# Altium schematic sheet TMC4671.SchDoc
size A4; SheetNumber: 2; SheetTotal: 7
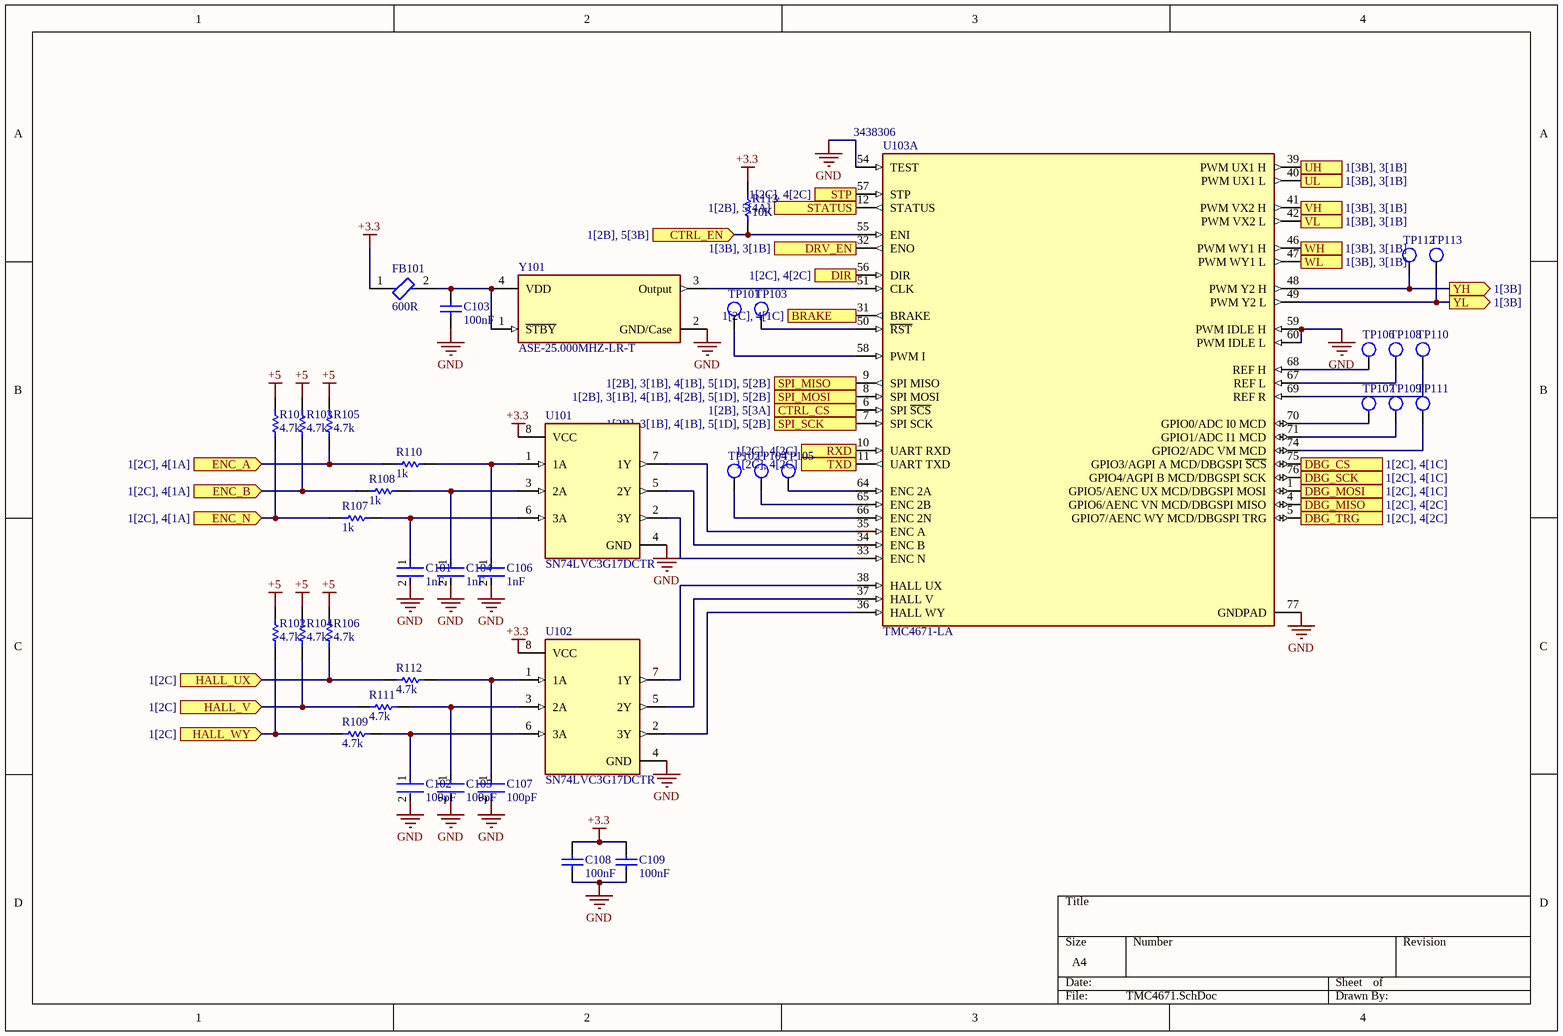
[diagram p0: TMC4671.SchDoc]

## Parts
C101  1nF  [FP-C0603C-CF-MFG]
C102  100pF  [FP-C0603C-CF-IPC_B]
C103  100nF  [CAPC1608X90X35NL10T15]
C104  1nF  [FP-C0603C-CF-MFG]
C105  100pF  [FP-C0603C-CF-IPC_B]
C106  1nF  [FP-C0603C-CF-MFG]
C107  100pF  [FP-C0603C-CF-IPC_B]
C108  100nF  [CAPC1608X90X35NL10T15]
C109  100nF  [CAPC1608X90X35NL10T15]
FB101  600R  [FP-742792651-MFG]
R101  4.7k  [RESC1608X55X30NL15T15]
R102  4.7k  [RESC1608X55X30NL15T15]
R103  4.7k  [RESC1608X55X30NL15T15]
R104  4.7k  [RESC1608X55X30NL15T15]
R105  4.7k  [RESC1608X55X30NL15T15]
R106  4.7k  [RESC1608X55X30NL15T15]
R107  1k  [RESC1608X55X30ML15T15]
R108  1k  [RESC1608X55X30ML15T15]
R109  4.7k  [RESC1608X55X30NL15T15]
R110  1k  [RESC1608X55X30ML15T15]
R111  4.7k  [RESC1608X55X30NL15T15]
R112  4.7k  [RESC1608X55X30NL15T15]
R113  10K  [RESC1609X55X30LL15T15]
TP101  TestPoint  [PCBComponent_1]  (value not drawn)  (no BOM)
TP102  TestPoint  [PCBComponent_1]  (value not drawn)  (no BOM)
TP103  TestPoint  [PCBComponent_1]  (value not drawn)  (no BOM)
TP104  TestPoint  [PCBComponent_1]  (value not drawn)  (no BOM)
TP105  TestPoint  [PCBComponent_1]  (value not drawn)  (no BOM)
TP106  TestPoint  [PCBComponent_1]  (value not drawn)  (no BOM)
TP107  TestPoint  [PCBComponent_1]  (value not drawn)  (no BOM)
TP108  TestPoint  [PCBComponent_1]  (value not drawn)  (no BOM)
TP109  TestPoint  [PCBComponent_1]  (value not drawn)  (no BOM)
TP110  TestPoint  [PCBComponent_1]  (value not drawn)  (no BOM)
TP111  TestPoint  [PCBComponent_1]  (value not drawn)  (no BOM)
TP112  TestPoint  [PCBComponent_1]  (value not drawn)  (no BOM)
TP113  TestPoint  [PCBComponent_1]  (value not drawn)  (no BOM)
U101  SN74LVC3G17DCTR  [FP-DCT0008A-IPC_B]
U102  SN74LVC3G17DCTR  [FP-DCT0008A-IPC_B]
U103  TMC4671-LA  Supplier Part Number 1: 3438306  [FP-TMC4671-LA-IPC_A]  (part A of 2)
Y101  ASE-25.000MHZ-LR-T  [FP-ASE-MFG]

## Ports
BRAKE (out, see 1[2C], 4[1C]), CTRL_CS (in, see 1[2B], 5[3A]), CTRL_EN (in, see 1[2B], 5[3B]), DBG_CS (out, see 1[2C], 4[1C]), DBG_MISO (in, see 1[2C], 4[2C]), DBG_MOSI (out, see 1[2C], 4[1C]), DBG_SCK (out, see 1[2C], 4[1C]), DBG_TRG (out, see 1[2C], 4[2C]), DIR (in, see 1[2C], 4[2C]), DRV_EN (out, see 1[3B], 3[1B]), ENC_A (in, see 1[2C], 4[1A]), ENC_B (in, see 1[2C], 4[1A]), ENC_N (in, see 1[2C], 4[1A]), HALL_UX (in, see 1[2C]), HALL_V (in, see 1[2C]), HALL_WY (in, see 1[2C]), RXD (in, see 1[2C], 4[2C]), SPI_MISO (out, see 1[2B], 3[1B], 4[1B], 5[1D], 5[2B]), SPI_MOSI (in, see 1[2B], 3[1B], 4[1B], 4[2B], 5[1D], 5[2B]), SPI_SCK (in, see 1[2B], 3[1B], 4[1B], 5[1D], 5[2B]), STATUS (out, see 1[2B], 5[4A]), STP (in, see 1[2C], 4[2C]), TXD (out, see 1[2C], 4[2C]), UH (out, see 1[3B], 3[1B]), UL (out, see 1[3B], 3[1B]), VH (out, see 1[3B], 3[1B]), VL (out, see 1[3B], 3[1B]), WH (out, see 1[3B], 3[1B]), WL (out, see 1[3B], 3[1B]), YH (out, see 1[3B]), YL (out, see 1[3B])

## Nets
+3.3: C108.1 C109.1 FB101.1 R113.2 U101.8(VCC) U102.8(VCC)
+5: R101.2 R102.2 R103.2 R104.2 R105.2 R106.2
GND: C101.2 C102.2 C103.2 C104.2 C105.2 C106.2 C107.2 C108.2 C109.2 U101.4(GND) U102.4(GND) U103.54(TEST) U103.59(PWM_IDLE_H) U103.60(PWM_IDLE_L) U103.77(GNDPAD) Y101.2(GND/Case)
BRAKE: U103.31(BRAKE) ; port BRAKE
CTRL_CS: U103.6(SPI_~{SCS}) ; port CTRL_CS
CTRL_EN: R113.1 U103.55(ENI) ; port CTRL_EN
DBG_CS: U103.75(GPIO3/AGPI_A_MCD/DBGSPI_~{SCS}) ; port DBG_CS
DBG_MISO: U103.4(GPIO6/AENC_VN_MCD/DBGSPI_MISO) ; port DBG_MISO
DBG_MOSI: U103.1(GPIO5/AENC_UX_MCD/DBGSPI_MOSI) ; port DBG_MOSI
DBG_SCK: U103.76(GPIO4/AGPI_B_MCD/DBGSPI_SCK) ; port DBG_SCK
DBG_TRG: U103.5(GPIO7/AENC_WY_MCD/DBGSPI_TRG) ; port DBG_TRG
DIR: U103.56(DIR) ; port DIR
DRV_EN: U103.32(ENO) ; port DRV_EN
ENC_A: R105.1 R110.1 ; port ENC_A
ENC_B: R103.1 R108.1 ; port ENC_B
ENC_N: R101.1 R107.1 ; port ENC_N
HALL_UX: R106.1 R112.2 ; port HALL_UX
HALL_V: R104.1 R111.2 ; port HALL_V
HALL_WY: R102.1 R109.2 ; port HALL_WY
RXD: U103.10(UART_RXD) ; port RXD
SPI_MISO: U103.9(SPI_MISO) ; port SPI_MISO
SPI_MOSI: U103.8(SPI_MOSI) ; port SPI_MOSI
SPI_SCK: U103.7(SPI_SCK) ; port SPI_SCK
STATUS: U103.12(STATUS) ; port STATUS
STP: U103.57(STP) ; port STP
TXD: U103.11(UART_TXD) ; port TXD
UH: U103.39(PWM_UX1_H) ; port UH
UL: U103.40(PWM_UX1_L) ; port UL
VH: U103.41(PWM_VX2_H) ; port VH
VL: U103.42(PWM_VX2_L) ; port VL
WH: U103.46(PWM_WY1_H) ; port WH
WL: U103.47(PWM_WY1_L) ; port WL
YH: TP112.1 U103.48(PWM_Y2_H) ; port YH
YL: TP113.1 U103.49(PWM_Y2_L) ; port YL
NetC101_1: C101.1 R107.2 U101.6(3A)
NetC102_1: C102.1 R109.1 U102.6(3A)
NetC103_1: C103.1 FB101.2 Y101.1(~{STBY}) Y101.4(VDD)
NetC104_1: C104.1 R108.2 U101.3(2A)
NetC105_1: C105.1 R111.1 U102.3(2A)
NetC106_1: C106.1 R110.2 U101.1(1A)
NetC107_1: C107.1 R112.1 U102.1(1A)
NetTP101_1: TP101.1 U103.58(PWM_I)
NetTP102_1: TP102.1 U103.66(ENC_2N)
NetTP103_1: TP103.1 U103.50(~{RST})
NetTP104_1: TP104.1 U103.65(ENC_2B)
NetTP105_1: TP105.1 U103.64(ENC_2A)
NetTP106_1: TP106.1 U103.68(REF_H)
NetTP107_1: TP107.1 U103.70(GPIO0/ADC_I0_MCD)
NetTP108_1: TP108.1 U103.67(REF_L)
NetTP109_1: TP109.1 U103.71(GPIO1/ADC_I1_MCD)
NetTP110_1: TP110.1 U103.69(REF_R)
NetTP111_1: TP111.1 U103.74(GPIO2/ADC_VM_MCD)
NetU101_2: U101.2(3Y) U103.33(ENC_N)
NetU101_5: U101.5(2Y) U103.34(ENC_B)
NetU101_7: U101.7(1Y) U103.35(ENC_A)
NetU102_2: U102.2(3Y) U103.36(HALL_WY)
NetU102_5: U102.5(2Y) U103.37(HALL_V)
NetU102_7: U102.7(1Y) U103.38(HALL_UX)
NetU103_51: U103.51(CLK) Y101.3(Output)

## Library data of the parts
C101 C104 C106 = CMP-2006-03015-2: CAP CER 1000PF 100V 10% X7R 0603; Manufacturer: KEMET; Manufacturer Part Number: C0603C102K1RACTU; Value: 1,000 pF; Tolerance: 0.1; Automotive Grade: Grade 1; Temperature Coefficient: 30ppm/°C; Material: Ceramic; Temperature Range High: +125°C; RoHS: TRUE; Temperature Range Low: -55°C; ComponentLink2URL: https://api.kemet.com/component-edge/download/datasheet/C0603C100J5GACAUTO.pdf; Lead Free: Yes; Device Class L2: Capacitors; Voltage Rating: 100 V; Package: C0603C-CF; Category: Cap; Temperature: -55°C to +125°C; Device Class L3: Ceramic Capacitors; Mouser Description: Multilayer Ceramic Capacitors MLCC - SMD/SMT 100volts 1000pF X7R 10%; Height: 0.87mm; ComponentLink2Description: Datasheet; Digikey Description: CAP CER 1000PF 100V 10% X7R 0603; Temperature Characteristic: X7R; Capacitance: 1,000 pF; Automotive: Yes; Octopart: https://octopart.com/c0603c102k1ractu-kemet-9138575; Device Class L1: Passive Components
C102 C105 C107 = CMP-2006-03007-2: CAP CER 100PF 50V 10% X7R 0603; Manufacturer: KEMET; Manufacturer Part Number: C0603C101K5RACTU; Tolerance: 0.1; Material: Ceramic; Temperature Coefficient: 30ppm/°C; Automotive Grade: Grade 1; Value: 100 pF; RoHS: TRUE; ComponentLink2Description: Datasheet; Device Class L2: Capacitors; Category: Cap; Package: C0603C-CF; Automotive: Yes; Temperature Range High: +125°C; Temperature Range Low: -55°C; Temperature Characteristic: X7R; Device Class L3: Ceramic Capacitors; Mouser Description: Multilayer Ceramic Capacitors MLCC - SMD/SMT 50volts 100pF 10%; Device Class L1: Passive Components; Capacitance: 100 pF; Height: 0.87mm; ComponentLink2URL: https://api.kemet.com/component-edge/download/datasheet/C0603C100J5GACAUTO.pdf; Temperature: -55°C to +125°C; Octopart: https://octopart.com/c0603c101k5ractu-kemet-10561249; Digikey Description: CAP CER 100PF 50V 10% X7R 0603; Voltage Rating: 50 V; Lead Free: Yes
C103 C108 C109 = CMP-2100-03643-1: Chip Capacitor, 0.1 uF, +/- 10%, 50 V, -55 to 125 degC, 0603 (1608 Metric), RoHS, Tape and Reel; Manufacturer: Murata; Dielectric Material: Ceramic; Voltage Rating: 50V; Dielectric: X7R; Insulation Resistance: 10GR; Case Code (Metric): 1608; Lead Free: LeadFree; Depth: 0.8mm; Number of Pins: 2; Radiation Hardening: No; Case/Package: 0603; Manufacturer URL: http://www.murata.com/; Packaging: TapeandReel; Length: 1.6mm; Contact Plating: Tin; Datasheet URL: http://psearch.en.murata.com/capacitor/product/GRM188R71H104KA93%23.pdf; Tolerance: 10%; Case Code (Imperial): 0603; Min Operating Temperature: -55degC; RoHSCompliant: true; Capacitance: 100nF; Voltage: 50V; Termination: SMD/SMT; Mount: SurfaceMount; Material: Ceramic; Package Quantity: 1; Height: 0.8mm; Thickness: 0.035inch; REACH SVHC: NoSVHC; Max Operating Temperature: 125degC; Width: 0.8mm; Package Reference: 0603; Voltage Rating (DC): 50V; Datasheet Version: 42675.0; Package Description: 2-Pin Surface Mount Device, Body 1.6 x 0.8 mm
FB101 = CMP-0220-00181-2: FERRITE BEAD 600 OHM 0603 1LN; Tolerance: 25%; DC Resistance (DCR): 200mR; Inductance: 0.36H; Current Rating: 1A; Test Frequency: 100MHz; Number of Lines: 1; Length: 1.6mm; Termination: SMD/SMT; Case Code (Metric): 1608; Case/Package: SMD/SMT; Min Operating Temperature: -55°C; Resistance: 200mR; Height: 0.8mm; Width: 0.8mm; Max Operating Temperature: 125°C; Package Quantity: 1; Mount: Surface Mount; Max DC Current: 1A; Max Current Rating: 1A; Weight: 0.000141oz; Packaging: Tape and Reel; Lead Free: Lead Free; Case Code (Imperial): 0603; Series: WE-CBF; Impedance: 600R; Core Material: Ferrite; Material: Ferrite; RoHS Compliant: Yes; Depth: 0.8mm
R101-R106 R109 R111 R112 = CMP-1012-00586-3: Precision Thick Film Chip Resistor, 4.7 KOhm, +/- 1%, -55 to 155 degC, 0603 (1608 Metric), RoHS, Tape and Reel; Resistance: 220 Ohm; Voltage Rating: 50 V; Elements: 4; Case\Package: 1205; Tolerance: 5%; Power Rating: 250 mW; PackageReference: 0603; Max Operating Temperature: 125 degC; REACH SVHC: No SVHC; Width: 0.063 inch; Length: 0.126 inch; Height: 0.024 inch; Mount: Surface Mount; Package Quantity: 1; DatasheetVersion: Apr-15; ComponentLink1Description: Manufacturer URL; Min Operating Temperature: -55 degC; Packaging: Tape and Reel; Radiation Hardening: No; ComponentLink2URL: http://industrial.panasonic.com/cdbs/www-data/pdf/RDA0000/AOA0000C86.pdf; Case Code (Metric): 3216; Pins: 8; Case Code (Imperial): 1206; Type (Resistor): Thick Film; RoHSCompliant: true; ComponentLink2Description: Datasheet; PackageDescription: 2-Pin Surface Mount Device, Body 1.6 x 0.85 mm; ComponentLink1URL: http://www.panasonic.com/
R107 R108 R110 = CMP-2000-00180-1: Part Number: ERJ-3EKF1001V; Manufacturer: Panasonic
R113 = CMP-1012-00623-3: Chip Resistor, 10 KOhm, +/- 1%, 0.1 W, -55 to 155 degC, 0603 (1608 Metric), RoHS, Tape and Reel; Manufacturer: Panasonic; Voltage Rating: 75V; Case\/Package: 0603; Power Rating: 100mW; Resistance: 10KOhm; Temperature Coefficient: 100ppm\/degreesC; Number of Pins: 2; Package Reference: 603; Depth: 0.8mm; Mount: SurfaceMount; Package Description: 2-Pin Surface Mount Device, Body 1.6 x 0.85 mm; Datasheet Version: 02/2017; Length: 1.6mm; Lead Free: LeadFree; Height: 0.45mm; Number of Terminations: 2; Max Power Dissipation: 100mW; Min Operating Temperature: -55degC; Datasheet URL: https://industrial.panasonic.com/cdbs/www-data/pdf/RDA0000/AOA0000C304.pdf; Termination: SMD/SMT; Case Code (Metric): 1608; Case Code (Imperial): 0603; Tolerance: 1%; Max Operating Temperature: 155degC; RoHSCompliant: true; Voltage Rating (DC): 75V; Radiation Hardening: No; Packaging: TapeandReel; Composition: ThickFilm; Mounting Technology: SurfaceMount; Manufacturer URL: http://www.panasonic.com/; Width: 0.031inch; REACH SVHC: NoSVHC; Contact Plating: Tin; Military Standard: Not; Package Quantity: 1
U101 U102 = CMP-0859-00525-5: IC BUFFER NON-INVERT 5.5V SM8; Manufacturer: Texas Instruments; Logic Function Desc: Non-Inverting; Propagation Delay: 5.1ns; Number Of Inputs: 3; Standoff Height: 0mm; Nominal Supply Current: 10uA; Min Supply Voltage: 1.65V; ComponentLink2URL: http://www.ti.com/lit/ds/symlink/sn74lvc3g17.pdf; Temperature: -40°C to +125°C; Device Class L1: Integrated Circuits (ICs); Mouser Description: Buffers & Line Drivers TRIPLE SCHMITT- TRIGGER BUFFER; Temperature Range Low: -40°C; Octopart: https://octopart.com/sn74lvc3g17dctr-texas+instruments-423176; Number Of Outputs: 3; Manufacturer Part Number: SN74LVC3G17DCTR; Device Class L2: Logic ICs; Ambient Temperature Range Low: -40°C; Max Supply Voltage: 5.5V; Automotive: No; Temperature Range High: +125°C; Category: IC; Digikey Description: IC BUFFER NON-INVERT 5.5V SM8; Package: DCT0008A; Device Class L3: Buffers; Height: 1.3mm; RoHS: TRUE; Lead Free: Yes; Ambient Temperature Range High: +125°C; Ipc Land Pattern Name: SOP65P400X130-8; ComponentLink2Description: Datasheet; Number Of Circuits: 3
U103 = CMP-237673-000008-1: SERVO CONTROLLER IC, QFN76; Supplier 1: Farnell
Y101 = CMP-27762-000357-1: XTAL Oscillator 25MHz ±25ppm CMOS 3.3V 4-SMD 3.2mm x 2.5mm; Min Supply Voltage: 3.135V; Max Supply Current: 13mA; Max Supply Voltage: 3.465V; Load Capacitance: 15pF; Height: 0.047inch; Series: ASE; Frequency Stability: 25ppm; Mount: Surface Mount; Case/Package: SMD/SMT; Width: 0.098inch; Operating Frequency: 25 MHz; REACH SVHC: No SVHC; Package Quantity: 1000; Number of Pins: 4; Termination: SMD/SMT; Frequency: 25MHz; Max Operating Temperature: 85°C; Packaging: Tape and Reel; Min Operating Temperature: -40°C; Lead Free: Lead Free; Length: 0.126inch; Operating Supply Voltage: 3.3V